# EAGLE design nonregulation-level-shifter-mk-1.1 (EAGLE 6.5.0)
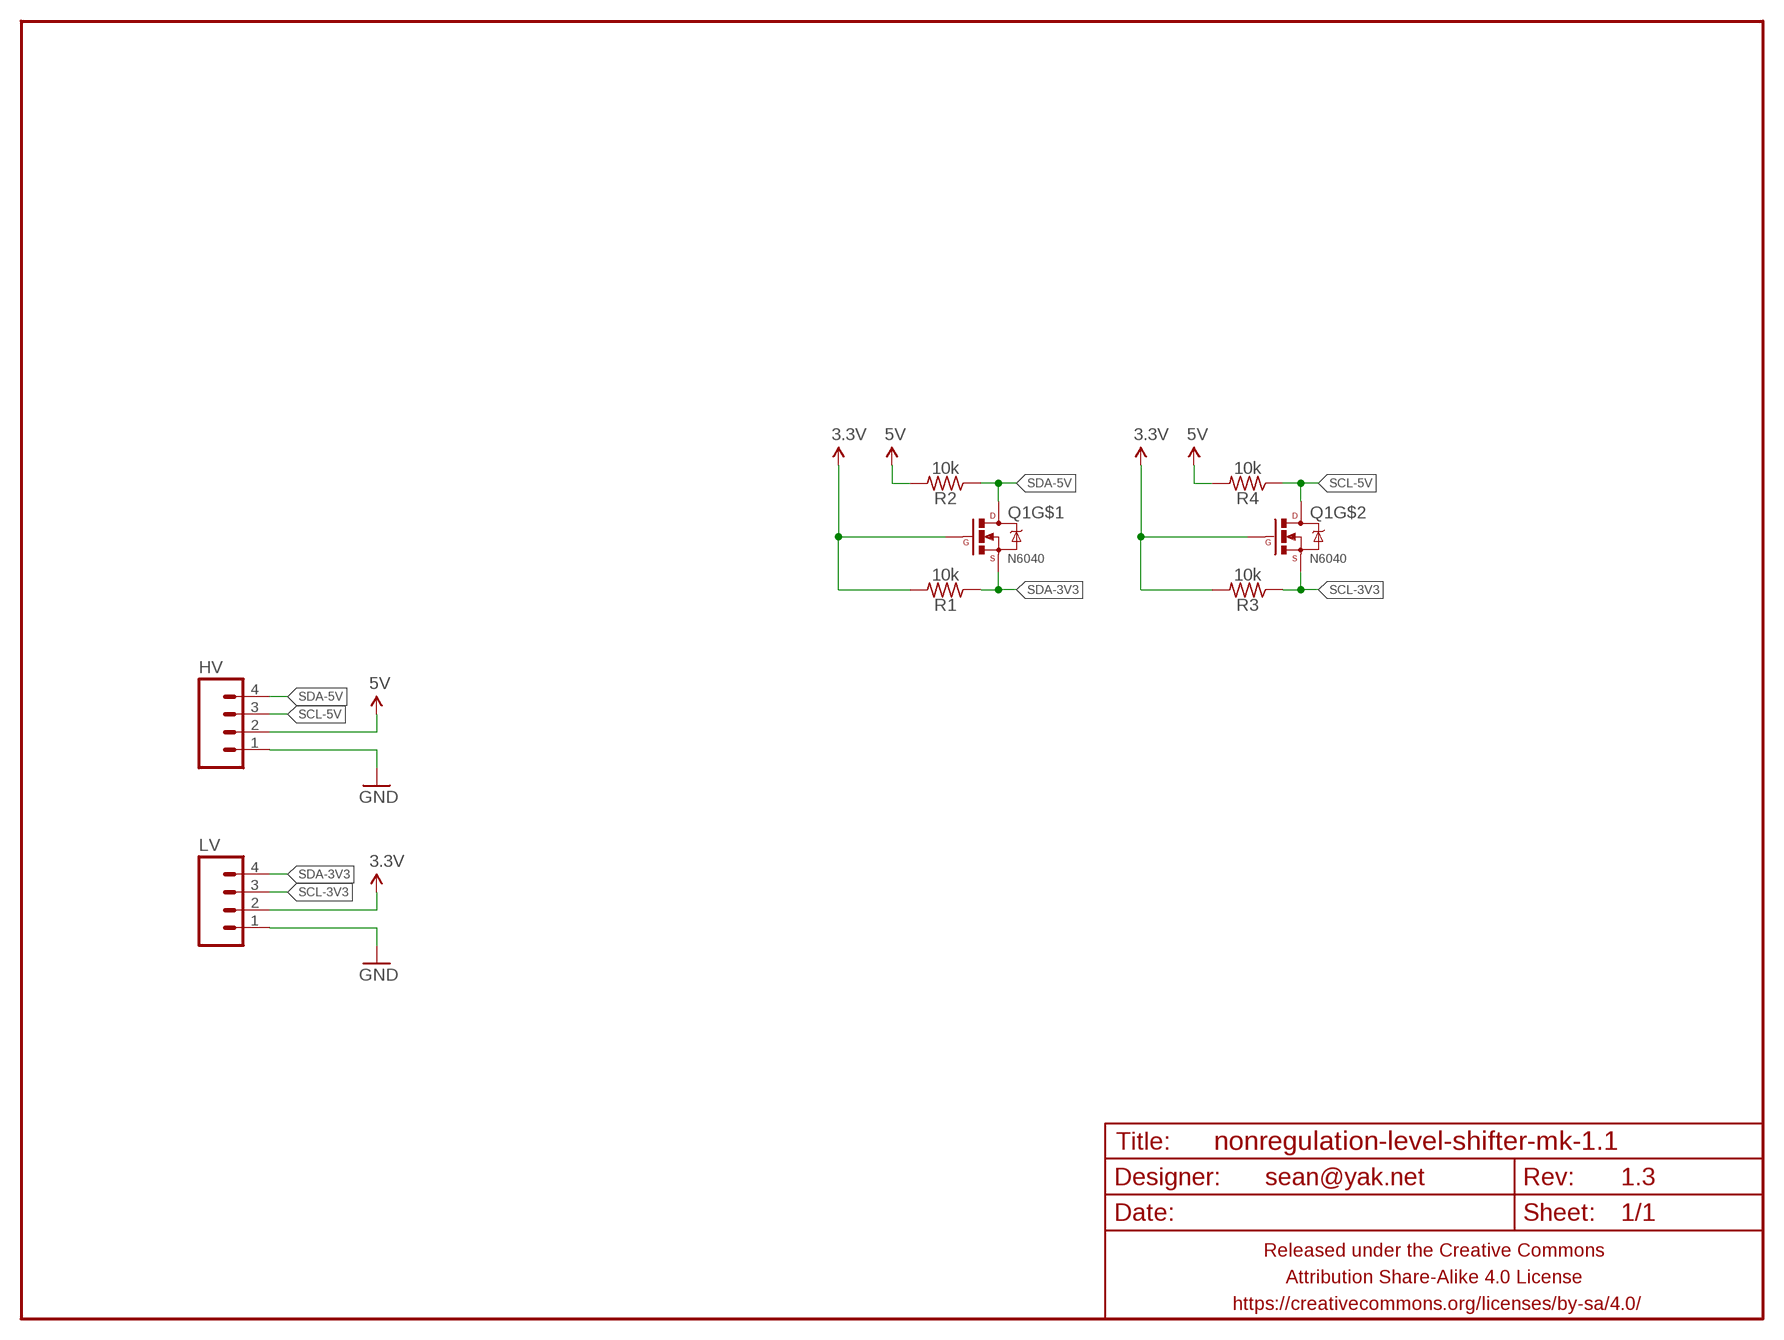
[diagram p0: schematic, sheet 1]

## Parts
FRAME1  FRAME-LETTERNO_PACKAGE  [DUMMY]
HV  M04PTH  [1X04-PTH-VERT]
LV  M04PTH  [1X04-PTH-VERT]
Q1  N6040  MOSFET-NCHANNEL-DUALSOIC8  [SO08]
R1  10k  RESISTORR0805  [R0805]
R2  10k  RESISTORR0805  [R0805]
R3  10k  RESISTORR0805  [R0805]
R4  10k  RESISTORR0805  [R0805]

## Nets
3.3V: LV.2 Q1.2(G) Q1.4(G) R1.2 R3.2
5V: HV.2 R2.2 R4.2
GND: HV.1 LV.1
SCL-3V3: LV.3 Q1.3(S) R3.1
SCL-5V: HV.3 Q1.5(D) Q1.6(D) R4.1
SDA-3V3: LV.4 Q1.1(S) R1.1
SDA-5V: HV.4 Q1.7(D) Q1.8(D) R2.1

## Library data of the parts
FRAME1 = A_butts:FRAME-LETTER: Schematic Frame Standard 8.5x11 US Letter frame; DESIGNER: sean@yak.net; VERSION: 1.3
HV LV = A_butts:M04: Header 4 Standard 4-pin 0.1" header. Use with straight break away headers (SKU : PRT-00116), right angle break away headers (PRT-00553), swiss pins (PRT-00743), machine pins (PRT-00117), and female headers (PRT-00115). Molex polarized connector foot print use with SKU : PRT-08231 with associated crimp pins and housings. 1MM SMD Version SKU: PRT-10208
Q1 = A_butts:MOSFET-NCHANNEL-DUAL
R1-R4 = A_butts:RESISTOR: RESISTOR, American symbol

## Board
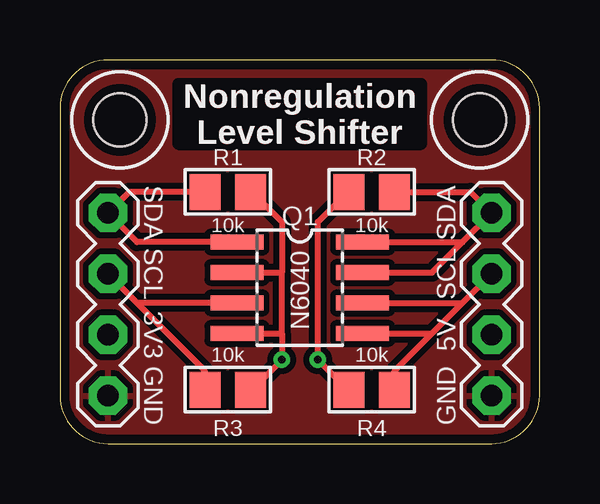
[diagram p1: board, top side]
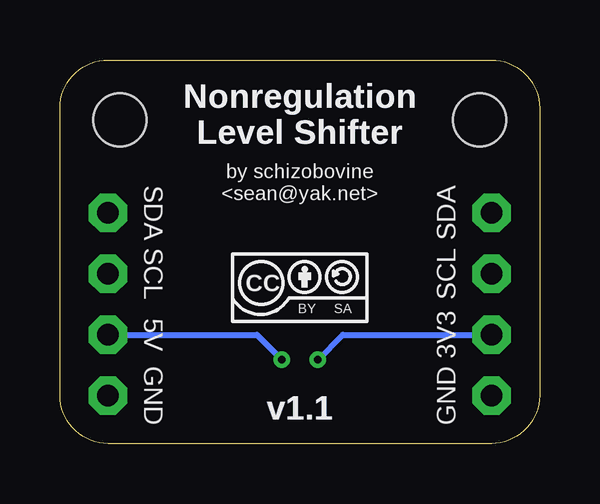
[diagram p2: board, bottom side, seen from below]

Size 20 x 16 mm. Coordinates in mm from the lower left corner, seen from the top.
Outline: 0,14 0,2 arc90 2,0 18,0 arc90 20,2 20,14 arc90 18,16 2,16 arc90 0,14
Copper layers (1*16): Top 0.0356mm / dielectric 1.5011mm / Bottom 0.0356mm
Design rules "LaenPCBOrder_2": minimum track width 6mil, minimum drill 13mil, track to track 6mil, track to pad 6mil, pad to pad 6mil, via to via 6mil, smd to smd 6mil, copper to edge 15mil, drill to drill 6mil, minimum pad ring 7mil, minimum via ring 7mil, stop-mask expansion 3mil, vias tented up to drill 20mil, thermal gap 10mil
Holes 2.2 mm at 2.5,13.5 17.5,13.5

### Footprints (pad centres in the part's own frame; a part is rotated, then mirrored left to right if it is on the bottom)
1X04-PTH-VERT = drill 0.9 pad 1.6 octagon: 1 0,0; 2 2.54,0; 3 5.08,0; 4 7.62,0
SO08 = smd 0.61 x 2.21: 1 -1.905,-2.616; 2 -0.635,-2.616; 3 0.635,-2.616; 4 1.905,-2.616; 5 1.905,2.616; 6 0.635,2.616; 7 -0.635,2.616; 8 -1.905,2.616
R0805 = smd 1.3 x 1.5: 1 -0.95,0; 2 0.95,0

### Placement (x,y rotation side)
FRAME1  0,0 0 top
HV  18,2 90 top
LV  2,2 90 top
Q1  10,6.5 270 top
R1  7,10.5 0 top
R2  13,10.5 180 top
R3  7,2.25 0 top
R4  13,2.25 180 top
U$1  [CC-BY-SA-4.0-NO-URL]  10,6.5 0 bottom

### Tracks (layer width: path | path; a pad name or v marks a point on that pad's centre or on a via)
3.3V  (via drill 0.33)
  Top 0.25: Q1.4 9.25,4.59 | Q1.2 9.25,7.13 | R1.2 8,10.5 9.25,9.25 9.25,7.13 | 9.25,4.59 9.25,7.13 | 9.25,4.59 v9.25,3.5 8,2.25 R3.2
  Bottom 0.25: v9.25,3.5 8.21,4.54 LV.2
5V  (via drill 0.33)
  Top 0.25: R4.2 12,2.25 v10.75,3.5 10.75,9.25 12,10.5 R2.2
  Bottom 0.25: HV.2 11.79,4.54 v10.75,3.5
GND
  pour Top (isolate 0.25): 20,0 0,0 0,16 20,16
SCL-3V3
  Top 0.25: Q1.3 3.21,5.87 | 3.21,5.87 LV.3 | R3.1 6.05,3.03 3.21,5.87
SCL-5V
  Top 0.25: Q1.6 16.79,5.87 | 16.79,5.87 HV.3 | Q1.5 15.52,4.59 | 15.52,4.59 16.79,5.87 | R4.1 13.95,3.03 15.52,4.59
SDA-3V3
  Top 0.25: Q1.1 3.21,8.4 LV.4 2.88,10.5 R1.1
SDA-5V
  Top 0.25: R2.1 17.12,10.5 HV.4 16.79,8.4 | Q1.8 16.79,8.4 | Q1.7 15.52,7.13 16.79,8.4

### Text on the board
Top: Nonregulation / Level Shifter
Bottom: Nonregulation / Level Shifter
tPlace: Nonregulation / Level Shifter
bPlace: Nonregulation / Level Shifter | by schizobovine / <sean@yak.net>
tNames: SDA | SDA | SCL | SCL | 3V3 | 5V | GND | GND
bNames: SDA | SDA | SCL | SCL | 3V3 | 5V | GND | GND